# EAGLE design RadioMusic_F rev2-1 (EAGLE 6.6.0)
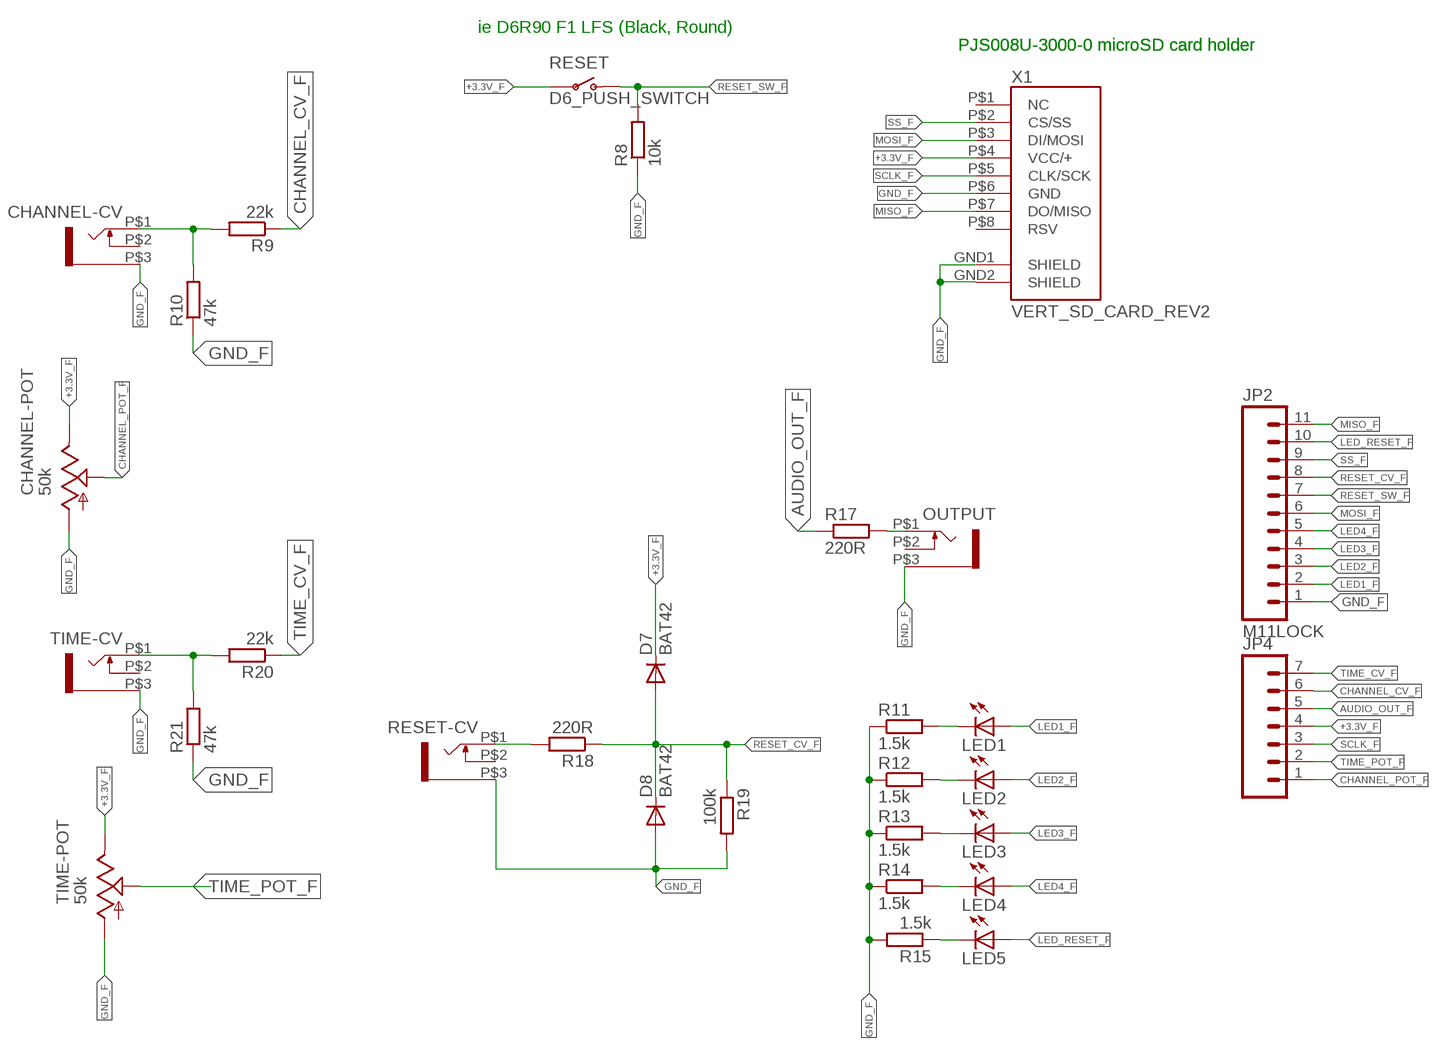
[diagram p0: schematic, sheet 1]

## Parts
CHANNEL-CV  WQP-PJ301M-12_JACK  [WQP-PJ301M-12_JACK]
CHANNEL-POT  50k  ALPHA-9MMF2A  [EVUF]
D7  BAT42  BAT81  [DO34-7]
D8  BAT42  BAT81  [DO34-7]
JP2  M11LOCK  [1X11_LOCK]
JP4  M07LOCK  [1X07_LOCK]
LED1  LED3MM  [LED3MM]
LED2  LED3MM  [LED3MM]
LED3  LED3MM  [LED3MM]
LED4  LED3MM  [LED3MM]
LED5  LED3MM  [LED3MM]
OUTPUT  WQP-PJ301M-12_JACK  [WQP-PJ301M-12_JACK]
R8  10k  R-EU_STANDARD_RESISTOR  [0207/10]
R9  22k  R-EU_STANDARD_RESISTOR  [0207/10]
R10  47k  R-EU_STANDARD_RESISTOR  [0207/10]
R11  1.5k  R-EU_STANDARD_RESISTOR  [0207/10]
R12  1.5k  R-EU_STANDARD_RESISTOR  [0207/10]
R13  1.5k  R-EU_STANDARD_RESISTOR  [0207/10]
R14  1.5k  R-EU_STANDARD_RESISTOR  [0207/10]
R15  1.5k  R-EU_STANDARD_RESISTOR  [0207/10]
R17  220R  R-EU_STANDARD_RESISTOR  [0207/10]
R18  220R  R-EU_STANDARD_RESISTOR  [0207/10]
R19  100k  R-EU_STANDARD_RESISTOR  [0207/10]
R20  22k  R-EU_STANDARD_RESISTOR  [0207/10]
R21  47k  R-EU_STANDARD_RESISTOR  [0207/10]
RESET  D6_PUSH_SWITCH  [D6_BUTTON_RND]
RESET-CV  WQP-PJ301M-12_JACK  [WQP-PJ301M-12_JACK]
TIME-CV  WQP-PJ301M-12_JACK  [WQP-PJ301M-12_JACK]
TIME-POT  50k  ALPHA-9MMF2A  [EVUF]
X1  VERT_SD_CARD_REV2  [VERT_MICROSD_REV2]

## Nets
+3.3V_F: CHANNEL-POT.3(E) D7.C JP4.4 RESET.P$3(P) RESET.P$4(P) TIME-POT.3(E) X1.P$4(VCC/+)
AUDIO_OUT_F: JP4.5 R17.1
CHANNEL_CV_F: JP4.6 R9.1
CHANNEL_POT_F: CHANNEL-POT.2(S) JP4.1
GND_F [ground]: CHANNEL-CV.P$3 CHANNEL-POT.1(A) D8.A JP2.1 OUTPUT.P$3 R8.1 R10.1 R11.1 R12.1 R13.1 R14.1 R15.2 R19.2 R21.1 RESET-CV.P$3 TIME-CV.P$3 TIME-POT.1(A) X1.GND1(SHIELD) X1.GND2(SHIELD) X1.P$6(GND)
LED1_F: JP2.2 LED1.A
LED2_F: JP2.3 LED2.A
LED3_F: JP2.4 LED3.A
LED4_F: JP2.5 LED4.A
LED_RESET_F: JP2.10 LED5.A
MISO_F: JP2.11 X1.P$7(DO/MISO)
MOSI_F: JP2.6 X1.P$3(DI/MOSI)
N$3: OUTPUT.P$1 R17.2
N$9: CHANNEL-CV.P$1 R9.2 R10.2
N$14: R18.2 RESET-CV.P$1
N$18: LED1.K(C) R11.2
N$19: LED2.K(C) R12.2
N$20: LED3.K(C) R13.2
N$21: LED4.K(C) R14.2
N$25: LED5.K(C) R15.1
RESET_CV_F: D7.A D8.C JP2.8 R18.1 R19.1
RESET_SW_F: JP2.7 R8.2 RESET.P$1(O) RESET.P$2(O)
SCLK_F: JP4.3 X1.P$5(CLK/SCK)
SS_F: JP2.9 X1.P$2(CS/SS)
TEMP: R20.2 R21.2 TIME-CV.P$1
TIME_CV_F: JP4.7 R20.1
TIME_POT_F: JP4.2 TIME-POT.2(S)
Unconnected: CHANNEL-CV.P$2 OUTPUT.P$2 RESET-CV.P$2 TIME-CV.P$2 X1.P$1(NC) X1.P$8(RSV)

## Notes on the sheet
- ie D6R90 F1 LFS (Black, Round)
- PJS008U-3000-0 microSD card holder | PJS008U-3000-0 microSD card holder

## Library data of the parts
CHANNEL-CV OUTPUT RESET-CV TIME-CV = thonkiconn:WQP-PJ301M-12_JACK
CHANNEL-POT TIME-POT = TomW:ALPHA-9MM: 9 mm Square Rotary Potentiometers Source: Panasonic
D7 D8 = diode:BAT81: DIODE barrier diode
JP2 = SparkFun-Connectors:M11: Header 11 Standard 11-pin 0.1" header. Use with straight break away headers (SKU : PRT-00116), right angle break away headers (PRT-00553), swiss pins (PRT-00743), machine pins (PRT-00117), and female headers (PRT-00115).
JP4 = SparkFun-Connectors:M07: Header 7 Standard 7-pin 0.1" header. Use with straight break away headers (SKU : PRT-00116), right angle break away headers (PRT-00553), swiss pins (PRT-00743), machine pins (PRT-00117), and female headers (PRT-00115). NOTES ON THE VARIANTS LOCK and LOCK_LONGPADS... This footprint was designed to help hold the alignment of a through-hole component (i.e. 7-pin header) while soldering it into place. You may notice that each hole has been shifted either up or down by 0.005 of an inch from it's more standard position (which is usually a perfectly straight line). This slight alteration caused the pins (the squares in the middle) to touch the edges of the holes. Because they are alternating, it causes a "brace" to hold the header in place. 0.005 has proven to be the perfect amount of "off-center" position when using our standard breakaway headers. Although looks a little odd when you look at the bare footprint, once you have a header in there, the alteration is very hard to notice. Also, if you push a header all the way into place, it is covered up entirely on the bottom side. This idea of altering the position of holes to aid alignment will be further integrated into the Sparkfun Library for other footprints. It can help hold any component with 3 or more connection pins.
LED1-LED5 = TomW:LED: LED OSRAM: - CHIPLED LG R971, LG N971, LY N971, LG Q971, LY Q971, LO R971, LY R971 LH N974, LH R974 LS Q976, LO Q976, LY Q976 LO Q996 - Hyper CHIPLED LW Q18S LB Q993, LB Q99A, LB R99A - SideLED LS A670, LO A670, LY A670, LG A670, LP A670 LB A673, LV A673, LT A673, LW A673 LH A674 LY A675 LS A676, LA A676, LO A676, LY A676, LW A676 LS A679, LY A679, LG A679 - Hyper Micro SIDELED® LS Y876, LA Y876, LO Y876, LY Y876 LT Y87S - SmartLED LW L88C, LW L88S LB L89C, LB L89S, LG L890 LS L89K, LO L89K, LY L89K LS L896, LA L896, LO L896, LY L896 - TOPLED LS T670, LO T670, LY T670, LG T670, LP T670 LSG T670, LSP T670, LSY T670, LOP T670, LYG T670 LG T671, LOG T671, LSG T671 LB T673, LV T673, LT T673, LW T673 LH T674 LS T676, LA T676, LO T676, LY T676, LB T676, LH T676, LSB T676, LW T676 LB T67C, LV T67C, LT T67C, LS T67K, LO T67K, LY T67K, LW E67C LS E67B, LA E67B, LO E67B, LY E67B, LB E67C, LV E67C, LT E67C LW T67C LS T679, LY T679, LG T679 LS T770, LO T770, LY T770, LG T770, LP T770 LB T773, LV T773, LT T773, LW T773 LH T774 LS E675, LA E675, LY E675, LS T675 LS T776, LA T776, LO T776, LY T776, LB T776 LHGB T686 LT T68C, LB T68C - Hyper Mini TOPLED® LB M676 - Mini TOPLED Santana® LG M470 LS M47K, LO M47K, LY M47K Source: http://www.osram.convergy.de LUXEON: - LUMILED® LXK2-PW12-R00, LXK2-PW12-S00, LXK2-PW14-U00, LXK2-PW14-V00 LXK2-PM12-R00, LXK2-PM12-S00, LXK2-PM14-U00 LXK2-PE12-Q00, LXK2-PE12-R00, LXK2-PE12-S00, LXK2-PE14-T00, LXK2-PE14-U00 LXK2-PB12-K00, LXK2-PB12-L00, LXK2-PB12-M00, LXK2-PB14-N00, LXK2-PB14-P00, LXK2-PB14-Q00 LXK2-PR12-L00, LXK2-PR12-M00, LXK2-PR14-Q00, LXK2-PR14-R00 LXK2-PD12-Q00, LXK2-PD12-R00, LXK2-PD12-S00 LXK2-PH12-R00, LXK2-PH12-S00 LXK2-PL12-P00, LXK2-PL12-Q00, LXK2-PL12-R00 Source: www.luxeon.com KINGBRIGHT: KA-3528ASYC Source: www.kingbright.com
R8-R15 R17-R21 = TomW:R-EU_: RESISTOR, European symbol
RESET = TomW:D6_PUSH_SWITCH
X1 = TomW:VERT_SD_CARD_REV2

## Net classes
0 default: width 0.305 mm
1 power: width 0.457 mm
2 ground: width 0.457 mm

## Board
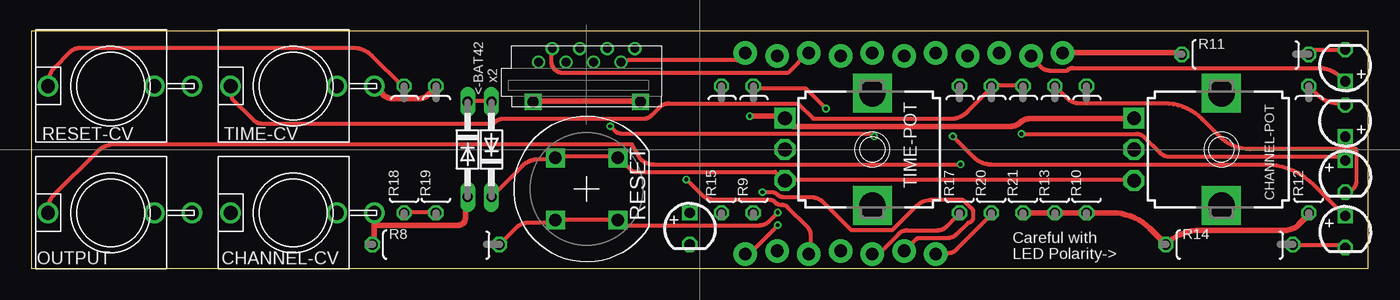
[diagram p1: board, top side]
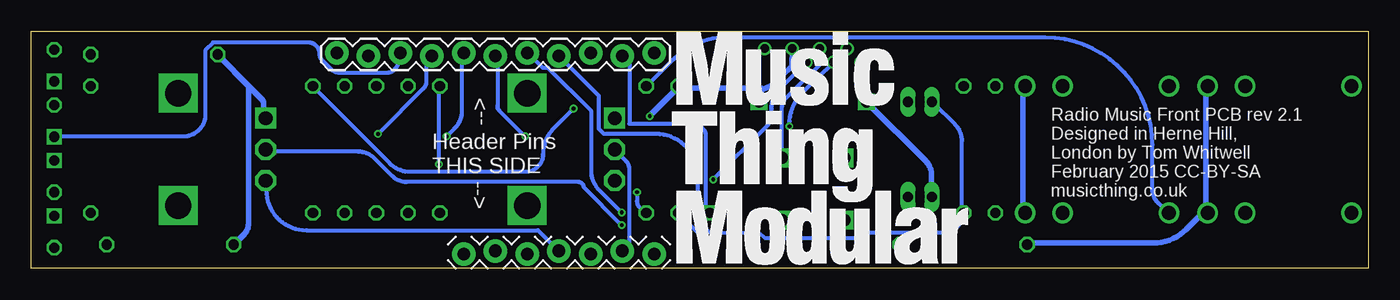
[diagram p2: board, bottom side, seen from below]

Size 107 x 19 mm. Coordinates in mm from the lower left corner, seen from the top.
Outline: 0,19 0,0 107,0 107,19 0,19
Copper layers (1*2*15*16): Top 0.035mm / dielectric 0.2mm / Route2 0.0175mm / dielectric 1.1mm / Route15 0.0175mm / dielectric 0.2mm / Bottom 0.035mm
Design rules "SeeedStudio_DRU_no_angle_20130527": minimum track width 6mil, minimum drill 12mil, track to track 6mil, track to pad 6mil, pad to pad 6mil, via to via 6mil, smd to smd 0mil, copper to edge 10mil, drill to drill 10mil, minimum pad ring 6mil, minimum via ring 6mil, stop-mask expansion 2mil, vias tented up to drill 25mil, thermal gap 10mil

### Footprints (pad centres in the part's own frame; a part is rotated, then mirrored left to right if it is on the bottom)
WQP-PJ301M-12_JACK = drill 1.1: P$1 0,5; P$2 0,-3.5; P$3 0,-6.5
EVUF = drill 1.1 pad 1.676 square: 1 -2.5,-7 | drill 1.1 pad 1.676 octagon: 2 0,-7; 3 2.5,-7 | drill 2.1 pad 2.8 square: M1 4.5,0; M2 -4.5,0
DO34-7 = drill 0.813 long: A 3.81,0; C -3.81,0
1X11_LOCK = drill 1.016 pad 1.88: 1 0,0.127; 2 2.54,-0.127; 3 5.08,0.127; 4 7.62,-0.127; 5 10.16,0.127; 6 12.7,-0.127; 7 15.24,0.127; 8 17.78,-0.127; 9 20.32,0.127; 10 22.86,-0.127; 11 25.4,0.127
1X07_LOCK = drill 1.016 pad 1.88: 1 0,0.127; 2 2.54,-0.127; 3 5.08,0.127; 4 7.62,-0.127; 5 10.16,0.127; 6 12.7,-0.127; 7 15.24,0.127
LED3MM = drill 0.813 square: A -1.27,0 | drill 0.813 octagon: K 1.27,0
0207/10 = drill 0.813 octagon: 1 -5.08,0; 2 5.08,0
D6_BUTTON_RND = drill 1 square: P$1 -2.5,2.5; P$2 2.5,2.5; P$3 2.5,-2.5; P$4 -2.5,-2.5
VERT_MICROSD_REV2 = drill 0.9 square: GND1 -4.3,-3.17; GND2 4.3,-3.17 | drill 0.7: P$1 -3.85,0; P$2 -2.75,1.1; P$3 -1.65,0; P$4 -0.55,1.1; P$5 0.55,0; P$6 1.65,1.1; P$7 2.75,0; P$8 3.85,1.1

### Placement (x,y rotation side)
CHANNEL-CV  20.95,4.45 90 top
CHANNEL-POT  95.25,9.53 270 top
D7  36.83,9.53 90 top
D8  34.92,9.53 270 top
JP2  82.55,17.14 0 bottom
JP4  57.15,1.27 180 bottom
LED1  105.16,16.26 90 top
LED2  105.16,11.81 90 top
LED3  105.16,7.37 270 top
LED4  105.16,2.92 270 top
LED5  52.7,3.17 270 top
OUTPUT  6.35,4.45 90 top
R8  32.38,1.91 0 top
R9  57.78,9.53 90 top
R10  84.45,9.53 90 top
R11  97.16,17.14 0 top
R12  102.23,9.53 90 top
R13  81.92,9.53 90 top
R14  95.89,1.91 0 top
R15  55.24,9.53 90 top
R17  74.3,9.53 90 top
R18  29.84,9.53 90 top
R19  32.38,9.53 90 top
R20  76.83,9.53 90 top
R21  79.38,9.53 90 top
RESET  44.45,6.35 180 top
RESET-CV  6.35,14.61 90 top
TIME-CV  20.95,14.61 90 top
TIME-POT  67.31,9.53 270 top
U$1  [MTM_2CM]  55.88,-0.64 0 bottom
X1  44.45,16.51 0 top

### Tracks (layer width: path | path; a pad name or v marks a point on that pad's centre or on a via)
+3.3V_F
  Top 0.305: D7.C 36.98,5.89 39.26,8.17 arc-45 40.63,8.74 41.86,8.74 RESET.P$3 42.06,8.94 46.94,8.94 RESET.P$4 47.14,8.74 48,7.88 arc45 48.38,7.72 59.54,7.72 60.15,7.11 TIME-POT.3 60.35,7.11 88.19,7.11 CHANNEL-POT.3
  Bottom 0.305: X1.P$4 43.87,16.33 46.53,13.72 arc-45 46.94,12.73 46.94,8.94 RESET.P$4 | JP4.4 64.82,1.42 66.45,3.05 85,3.05 arc90 88.19,6.24 88.19,6.91 CHANNEL-POT.3
AUDIO_OUT_F
  Top 0.305: R17.1 74.17,4.27 73.23,3.33 arc-45 72.56,3.05 70.09,3.05 arc45 69.42,2.77 67.87,1.22 67.46,1.22 JP4.5
CHANNEL_CV_F  (via drill 0.3)
  Top 0.305: v58.52,6.1 59.28,6.1 arc-45 59.72,5.92 59.72,5.91 arc45 60.26,5.69 62.39,5.69 arc-45 63.42,5.26 65.63,3.05 68.89,3.05 70.74,4.9 arc-45 72.15,5.49 74.4,5.49 arc-45 74.7,5.36 75.26,4.8 arc-45 75.39,4.49 75.39,4.06 arc-90 74.98,3.66 74.07,2.74 arc-45 73.33,2.44 71.15,2.44 arc45 70.75,2.27 69.9,1.42 JP4.6
  Bottom 0.305: v58.52,6.1 58.52,5.38 arc-45 58.31,4.86 57.91,4.47 R9.1
CHANNEL_POT_F  (via drill 0.3)
  Top 0.305: v59.74,3.45 57.51,1.22 57.3,1.22 JP4.1
  Bottom 0.305: v59.74,3.45 62.79,6.5 arc-90 63.2,6.91 76.98,6.91 arc45 78.08,7.37 79.53,8.81 arc-45 80.82,9.35 88.19,9.35 CHANNEL-POT.2
GND_F  (via drill 0.3)
  Top 0.457: X1.GND1 40.23,13.41 48.56,13.41 X1.GND2 | R19.2 32.31,14.43 31.81,13.93 arc-45 31.06,13.61 28.86,13.61 arc-45 28.16,13.91 27.64,14.43 TIME-CV.P$3 | 27.43,3.45 27.43,4.27 CHANNEL-CV.P$3 | 27.43,3.45 27.43,2.03 R8.1 | 27.43,3.45 34.17,3.45 arc90 34.75,4.03 34.75,5.69 D8.A | R12.1 102.21,4.27 101.44,3.5 arc-45 100.35,3.05 93.56,3.05 arc45 R14.1 89.51,3.2 arc45 86.5,4.45 R10.1 R13.1 R21.1 | CHANNEL-POT.1 88.19,11.99 79.9,11.99 arc45 79.14,11.67 arc-45 78.42,11.38 60.96,11.38 60.35,11.99 TIME-POT.1 60.15,12.19 v57.51,12.19 | JP2.1 92.05,17.27 R11.1
  Bottom 0.457: 48.46,14.33 48.56,14.22 48.56,13.41 X1.GND2 | 48.46,14.33 47.75,14.66 46.1,16.2 X1.P$6 | 48.46,14.33 48.56,14.43 55.07,14.43 R15.2 55.27,14.43 v57.51,12.19 | RESET-CV.P$3 13.01,14.43 13.01,4.47 OUTPUT.P$3 13.21,4.47 14.56,3.12 arc45 17.19,2.03 27.23,2.03 R8.1 | TIME-CV.P$3 27.64,14.43 27.64,4.47 CHANNEL-CV.P$3 | X1.GND1 40.03,13.21 35.45,8.62 arc45 34.95,7.43 34.95,5.89 D8.A | 89.51,14.53 88.54,13.56 arc45 88.39,13.2 88.39,12.19 CHANNEL-POT.1 | 89.51,14.53 92.05,17.07 R11.1 | R14.1 90.63,2.03 90.03,2.63 arc-45 89.61,3.63 89.61,14.43 89.51,14.53
LED1_F
  Top 0.305: LED1.A 105.05,15.04 104.74,15.35 arc45 103.05,16.05 83.4,16.05 arc45 82.91,15.85 81.52,15.85 arc-45 80.76,16.16 80.06,16.87 JP2.2
LED2_F
  Bottom 0.305: LED2.A 105.05,10.57 94.82,10.57 arc-90 93.07,12.32 93.07,17.48 92.46,18.09 84.81,18.09 arc90 83.92,17.19 arc-45 83.69,16.64 83.05,15.99 arc-45 82.22,15.65 78.61,15.65 arc-90 77.62,16.64 77.62,17.27 JP2.3
LED3_F  (via drill 0.3)
  Top 0.305: LED3.A 104.85,8.94 91.14,8.94 arc-45 90.27,9.3 89.04,10.53 arc45 88.46,10.77 v79.25,10.77
  Bottom 0.305: v79.25,10.77 75.62,14.39 arc-45 75.39,14.97 75.39,16.46 74.98,16.87 JP2.4
LED4_F  (via drill 0.3)
  Top 0.305: v73.76,10.57 75.44,8.89 arc45 76.78,8.33 98.7,8.33 arc-45 102.61,6.71 105.05,4.27 LED4.A
  Bottom 0.305: v73.76,10.57 73.12,11.21 arc-45 72.54,12.6 72.54,17.27 JP2.5
LED_RESET_F
  Bottom 0.305: JP2.10 59.13,16.46 59.13,11.58 54.25,11.58 arc45 53.22,11.15 arc45 53.03,10.72 53.03,4.67 52.83,4.47 LED5.A
MISO_F
  Top 0.305: X1.P$7 47.75,16.66 56.49,16.66 57.1,17.27 JP2.11
MOSI_F  (via drill 0.3)
  Top 0.305: v46.33,11.38 46.66,11.05 arc45 47.33,10.77 67.26,10.77 v67.46,10.57
  Bottom 0.305: v46.33,11.38 46.33,11.45 arc46 45.13,14.26 42.85,16.46 X1.P$3 | v67.46,10.57 69.55,12.66 arc45 69.7,13.01 69.7,16.87 JP2.6
N$3  (via drill 0.3)
  Top 0.305: v74.37,8.33 49.82,8.33 arc-45 48.72,8.79 48.06,9.96 6.73,9.96 arc45 5.3,9.37 1.77,5.83 arc45 1.42,4.99 1.42,4.47 OUTPUT.P$1
  Bottom 0.305: v74.37,8.33 74.37,14.43 R17.2
N$9  (via drill 0.3)
  Top 0.305: v63.6,12.8 61.98,14.43 57.91,14.43 R9.2
  Bottom 0.305: R9.2 57.71,14.63 55.56,16.78 arc45 51.43,18.49 25.85,18.49 arc90 17.27,9.91 17.27,6.33 arc-45 16.82,5.24 16.05,4.47 CHANNEL-CV.P$1 | v63.6,12.8 65.18,11.22 arc-45 66.04,9.15 arc90 67.47,7.72 76.67,7.72 arc45 78.3,8.39 84.33,14.43 R10.2
N$14
  Top 0.305: R18.2 29.67,14.63 27.26,17.04 arc45 25.72,17.68 3.96,17.68 arc45 3.1,17.32 1.87,16.09 arc45 1.42,15.01 1.42,14.63 RESET-CV.P$1
N$18
  Top 0.305: R11.2 102.41,17.27 102.62,17.48 105.05,17.48 LED1.K
N$19
  Top 0.305: R12.2 102.95,13.89 arc45 104.6,13.21 105.05,13.21 LED2.K
N$20
  Top 0.305: R13.2 82.88,13.64 arc45 83.93,13.21 90.68,13.21 arc-45 93.72,11.95 95.11,10.55 arc45 97.53,9.55 106.07,9.55 106.07,7.01 arc-90 LED3.K
N$21
  Top 0.305: R14.2 100.99,1.83 105.05,1.83 LED4.K
N$25
  Bottom 0.305: R15.1 LED5.K
RESET_CV_F
  Top 0.305: D8.C 34.95,13.41 36.78,13.41 D7.A | R18.1 29.87,4.47 32.31,4.47 R19.1
  Bottom 0.305: D8.C 34.75,13.21 33.05,11.51 arc45 32.51,10.21 32.51,4.47 R19.1 32.51,4.27 arc90 33.93,2.85 40.26,2.85 40.89,2.41 48.26,2.41 48.77,2.79 52.32,2.85 arc45 53.19,3.21 53.65,3.66 53.65,7.41 arc-90 57.01,10.77 61.16,10.77 61.57,11.18 61.57,13.82 JP2.8
RESET_SW_F  (via drill 0.3)
  Top 0.305: R8.2 38.82,3.26 arc-45 39.78,3.66 41.86,3.66 RESET.P$2 42.06,3.86 46.94,3.86 RESET.P$1 47.35,3.45 58.3,3.45 arc45 59.03,3.76 v59.74,4.47
  Bottom 0.305: v59.74,4.47 61.51,6.24 arc45 62.18,7.86 62.18,12.6 65.63,16.05 66.04,16.05 67.26,17.27 JP2.7
SCLK_F  (via drill 0.3)
  Top 0.305: v52.43,7.11 53.58,5.96 arc45 54.71,5.49 59.13,5.49 arc-45 59.48,5.34 59.55,5.27 arc45 60.01,5.08 60.09,5.08 arc-45 60.54,4.89 62.15,3.28 arc-45 62.38,2.72 62.38,1.22 JP4.3
  Bottom 0.305: v52.43,7.11 48.1,11.44 arc-45 47.75,12.27 47.75,12.78 arc45 47.09,14.38 45.39,16.08 X1.P$5
SS_F
  Top 0.305: X1.P$2 41.63,17.48 41.63,16.59 arc90 42.57,15.65 60.55,15.65 62.18,17.27 JP2.9
TEMP
  Top 0.305: R21.2 79.25,14.63 77.01,14.63 R20.2 76.81,14.43 74.93,12.55 arc-45 73.58,11.99 62.59,11.99 61.37,13.21 51,13.21 arc45 50.31,12.92 49.63,12.24 arc-45 49.02,11.99 37.76,11.99 arc45 37.12,11.72 arc-45 36.78,11.58 18.57,11.58 arc-45 17.74,11.92 16.05,13.61 16.05,14.43 TIME-CV.P$1
TIME_CV_F
  Top 0.305: R20.1 76.81,4.27 74.06,1.51 arc-45 73.34,1.22 72.54,1.22 JP4.7
TIME_POT_F
  Bottom 0.305: TIME-POT.2 60.15,9.35 59.4,8.6 arc45 59.13,7.96 59.13,1.83 59.54,1.42 JP4.2

### Text on the board
tPlace: <-BAT42 / x2 | Careful with / LED Polarity->
bPlace: --> | Header Pins / THIS SIDE | --> | Radio Music Front PCB rev 2.1 / Designed in Herne Hill, / London by Tom Whitwell / February 2015 CC-BY-SA / musicthing.co.uk